# EasyEDA schematic VFD_Clock.json
TITLE: Sheet_1; REV: 1.0; Date: 2023-11-03; Sheet: 1/1; Drawn By: a_qin; Company: Your Company
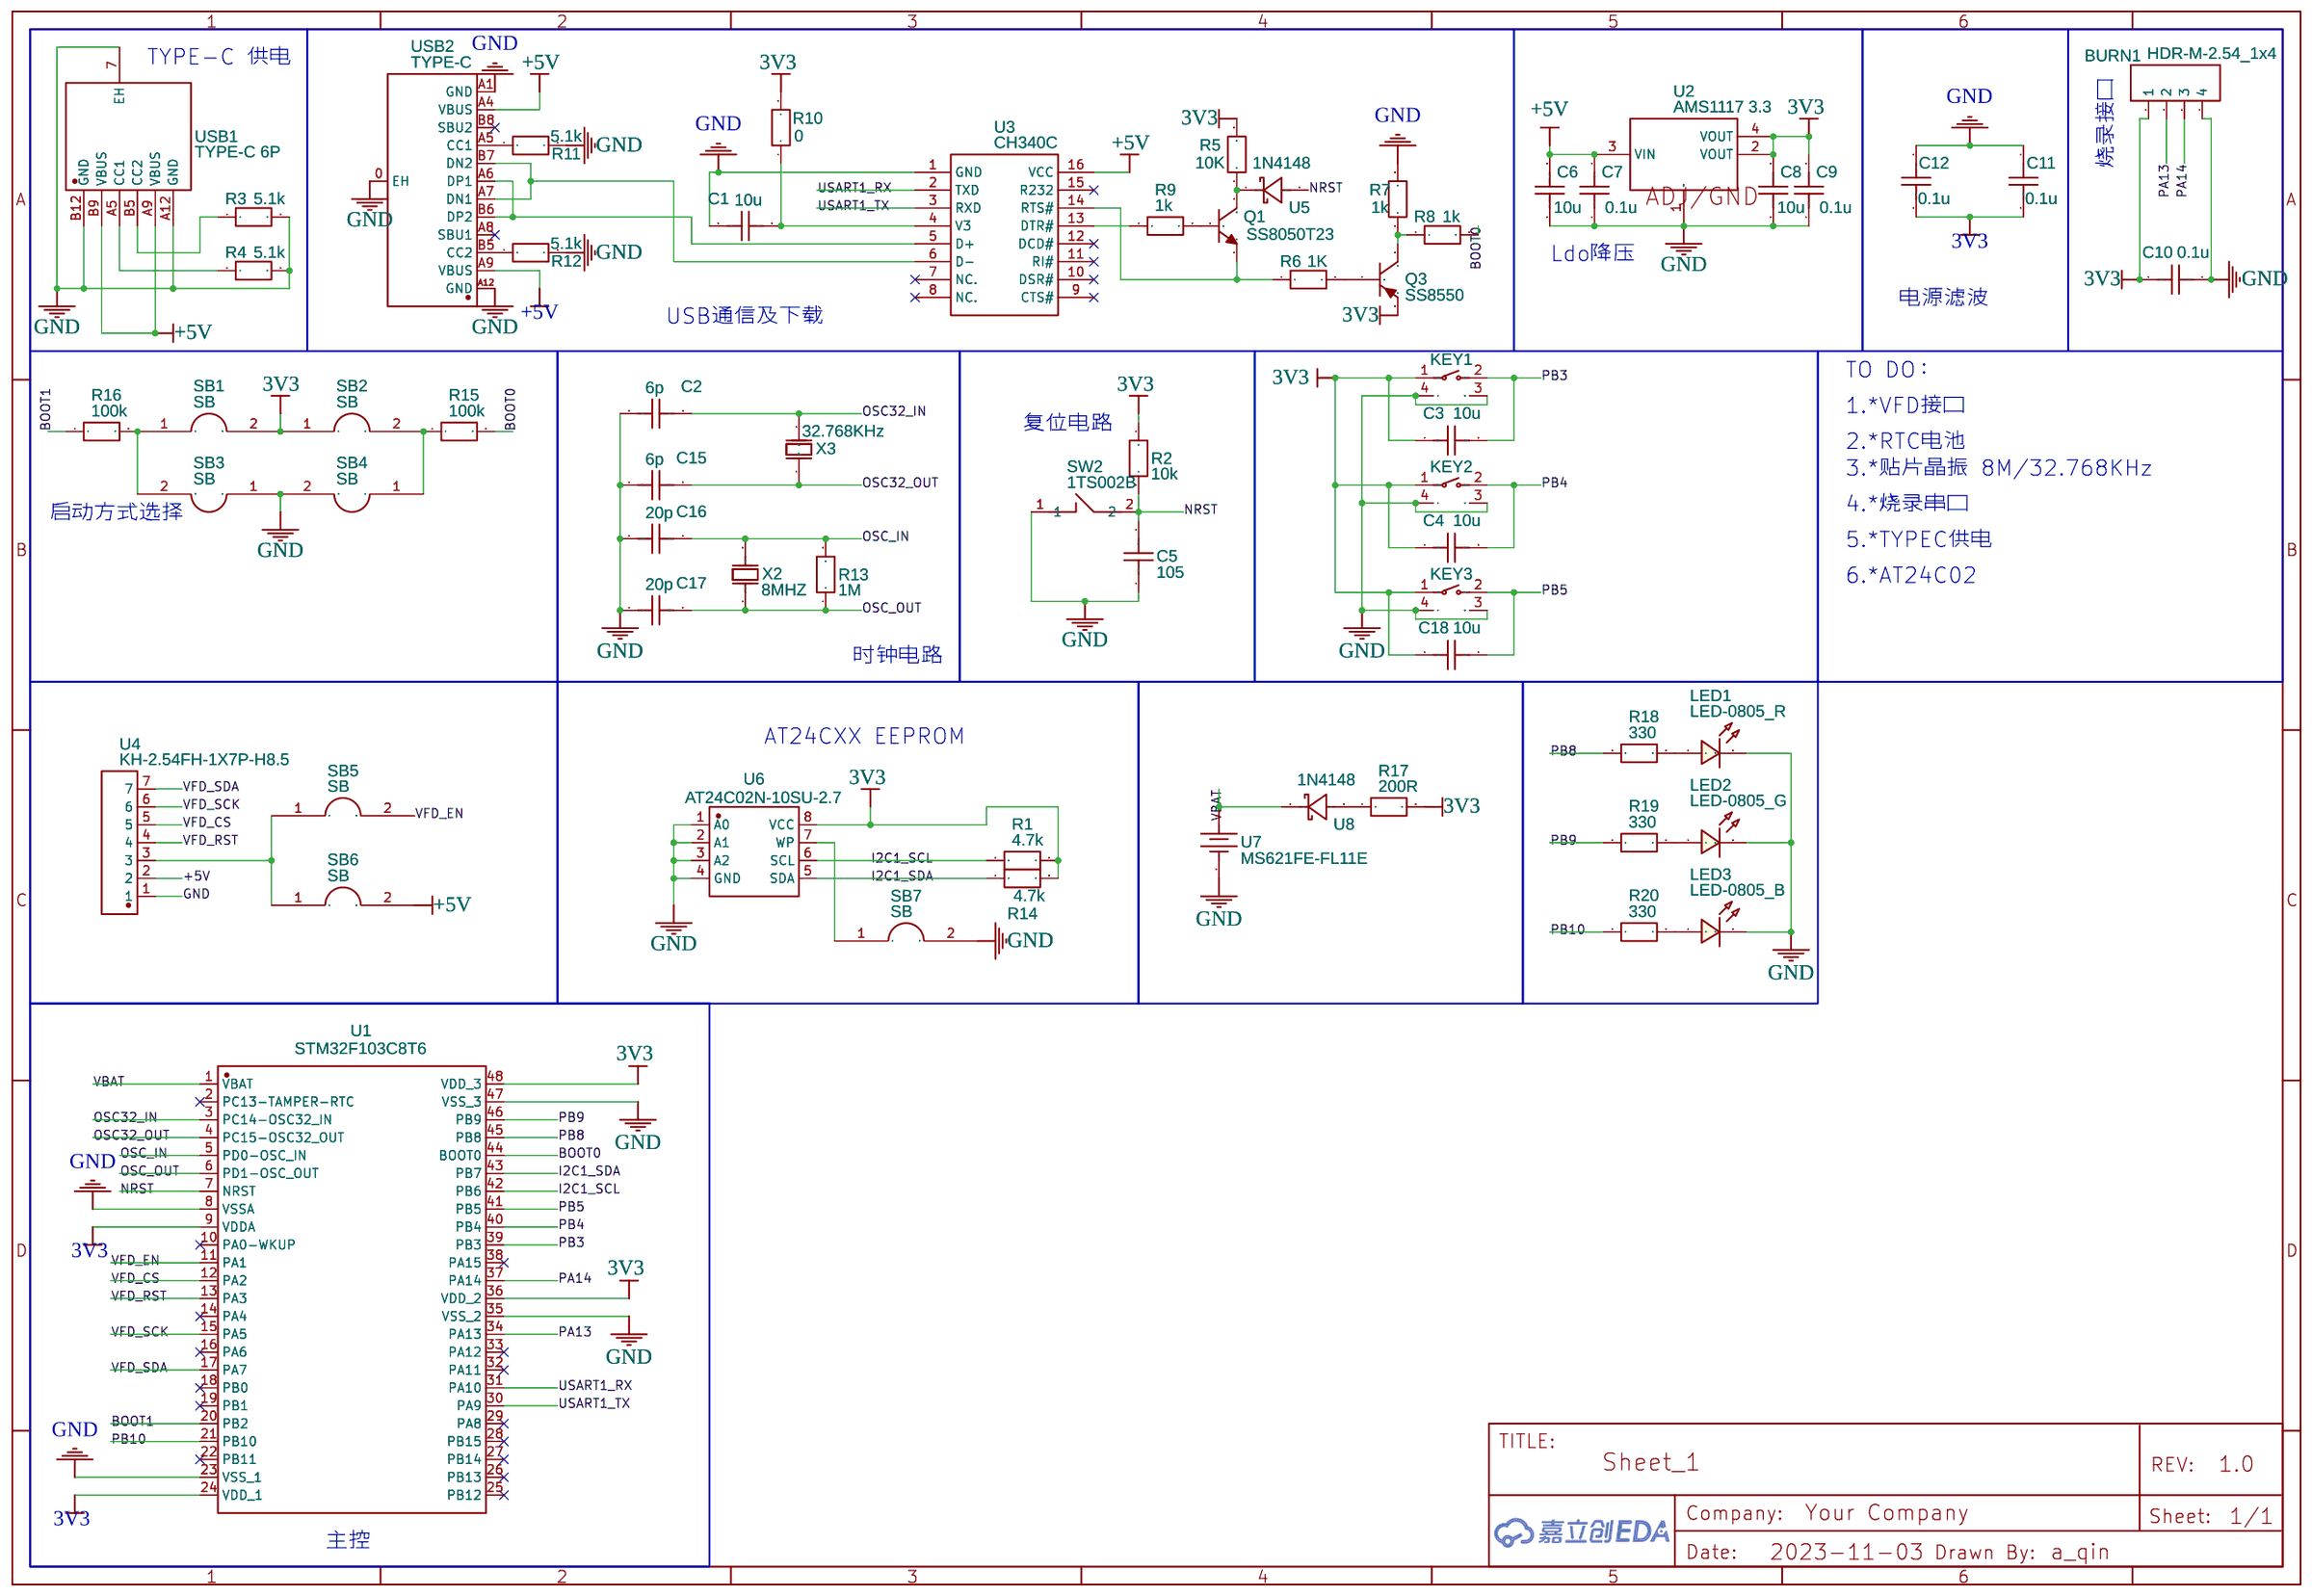
[diagram p0: schematic sheet]

## Parts
BURN1  HDR-M-2.54_1x4  [HDR-M-2.54_1X4]
C1  10u  [C0805]
C2  6p  [C0805]
C3  10u  [C0805]
C4  10u  [C0805]
C5  105  [C0805]
C6  10u  [C0805]
C7  0.1u  [C0805]
C8  10u  [C0805]
C9  0.1u  [C0805]
C10  0.1u  [C0805]
C11  0.1u  [C0805]
C12  0.1u  [C0805]
C15  6p  [C0805]
C16  20p  [C0805]
C17  20p  [C0805]
C18  10u  [C0805]
KEY1  K2-1102AQ-C4CW-01  [SW-TH_K2-1102AQ-C4CW-01]
KEY2  K2-1102AQ-C4CW-01  [SW-TH_K2-1102AQ-C4CW-01]
KEY3  K2-1102AQ-C4CW-01  [SW-TH_K2-1102AQ-C4CW-01]
LED1  LED-0805_R  [LED0805_RED]
LED2  LED-0805_G  [LED0805_GREEN]
LED3  LED-0805_B  [LED0805_BLUE]
Q1  SS8050T23  [SOT-23-3_L2.9-W1.3-P1.90-LS2.4-BR]
Q3  SS8550  [SOT-23-3_L2.9-W1.3-P1.90-LS2.4-BR]
R1  4.7k  [R0805]
R2  10k  [R0805]
R3  5.1k  [R0805]
R4  5.1k  [R0805]
R5  10K  [R0805]
R6  1K  [R0805]
R7  1k  [R0805]
R8  1k  [R0805]
R9  1k  [R0805]
R10  0  [R0805]
R11  5.1k  [R0805]
R12  5.1k  [R0805]
R13  1M  [R0805]
R14  4.7k  [R0805]
R15  100k  [R0805]
R16  100k  [R0805]
R17  200R  [R0805]
R18  330  [R0805]
R19  330  [R0805]
R20  330  [R0805]
SB1  SB  [SB]
SB2  SB  [SB]
SB3  SB  [SB]
SB4  SB  [SB]
SB5  SB  [SB]
SB6  SB  [SB]
SB7  SB  [SB]
SW2  1TS002B  [SW-SMD_L6.0-W3.5-LS8.0]
U1  STM32F103C8T6  [LQFP-48_L7.0-W7.0-P0.50-LS9.0-BL]
U2  AMS1117 3.3  [SOT-223-3_L6.7-W3.7-P2.30-LS7.0-BR]
U3  CH340C  [SOP-16_L10.0-W3.9-P1.27-LS6.0-BL]
U4  KH-2.54FH-1X7P-H8.5  [HDR-TH_7P-P2.54-V-F]
U5  1N4148  [SOD-323_L1.8-W1.3-LS2.7-RD]
U6  AT24C02N-10SU-2.7  [SOIC-8_L4.9-W3.9-P1.27-LS6.0-BL]
U7  MS621FE-FL11E  [BAT-SMD_FL11E]
U8  1N4148  [SOD-323_L1.8-W1.3-LS2.7-RD]
USB1  TYPE-C 6P  [TYPE-C-SMD_TYPE-C-6P]
USB2  TYPE-C  [USB-TYPE-C-SMD_TYPE-C-16P-QTWT]
X2  8MHZ  [HC-49US_L11.0-W4.6-P4.88]
X3  32.768KHz  [OSC-TH_BD2.1-P0.70-D0.3]

## Library data of the parts
BURN1 = HDR-M-2.54_1x4: Supplier Part: C124378; Supplier: LCSC; Contributor: LCEDA_Lib
C1-C12 C15-C18 = C_0805_US: Contributor: LCEDA_Lib
KEY1-KEY3 = K2-1102AQ-C4CW-01: Supplier: LCSC; Manufacturer: 韩国韩荣; Contributor: LCSC; Supplier Part: C127680; JLCPCB Part Class: Extended Part
LED1 = LED-0805_R: Manufacturer: EVERLIGHT(台湾亿光); Manufacturer Part: 17-21SURC/S530-A3/TR8; Supplier Part: C72037; Contributor: LCEDA_Lib
LED2 = LED-0805_G: Manufacturer: 国星光电; Manufacturer Part: NCD0805G1; Supplier Part: C84260; Contributor: LCEDA_Lib
LED3 = LED-0805_B: Manufacturer: 方舟 ARKLED; Manufacturer Part: D-B080508B1-KS2; Supplier Part: C108412; Contributor: LCEDA_Lib
Q1 = SS8050T23: Supplier: LCSC; Supplier Part: C2939671; Manufacturer: Me-TECH(美台高科); Contributor: LCSC; JLCPCB Part Class: Extended Part
Q3 = SS8550-C148468: Supplier: LCSC; Manufacturer: Yenji; Contributor: 立创EDA官方封装库; Supplier Part: C148468
R1-R20 = R_0805_EU: Contributor: LCEDA_Lib
SB1-SB7 = SB: Contributor: lalalaersha
SW2 = 1TS002B-2700-5001: Supplier: LCSC; Supplier Part: C319335; Manufacturer: HYP(鸿源精密); Manufacturer Part: 1TS002B-2700-5001-CT; Contributor: LCSC
U1 = STM32F103C8T6: Supplier: LCSC; Manufacturer: ST(意法半导体); Supplier Part: C8734; JLCPCB Part Class: Basic Part
U2 = LD1117ASTR: Supplier: LCSC; Supplier Part: C283464; Manufacturer: ST(意法半导体); Contributor: LCSC; JLCPCB Part Class: Extended Part
U3 = CH340C: Supplier: LCSC; Manufacturer: WCH(南京沁恒); Supplier Part: C84681; JLCPCB Part Class: Extended Part; link: https://so.szlcsc.com/global.html?k=C84681&ref=editor
U4 = KH-2.54FH-1X7P-H8.5: Contributor: LCSC; Supplier: LCSC; Supplier Part: C2932672; Manufacturer: kinghelm(金航标); JLCPCB Part Class: Extended Part; link: https://so.szlcsc.com/global.html?k=C2932672&ref=editor
U5 U8 = 1N4148WS-HG3-08: Supplier: LCSC; Supplier Part: C3313072; Manufacturer: VISHAY(威世); JLCPCB Part Class: Extended Part; Contributor: lcsc
U6 = AT24C02N-10SU-2.7: Supplier: LCSC; Supplier Part: C2929937; Manufacturer: null; Contributor: LCSC; JLCPCB Part Class: Extended Part
U7 = MS621FE-FL11E: Contributor: LCSC; Supplier: LCSC; Supplier Part: C80909; Manufacturer: Seiko(精工); link: https://so.szlcsc.com/global.html?k=C80909&ref=editor
USB1 = TYPE-C 6P: Supplier: LCSC; Supplier Part: C456012; Manufacturer: SHOU HAN(首韩); Contributor: LCSC; JLCPCB Part Class: Extended Part
USB2 = TYPE-C 16P QTWT: Supplier: LCSC; Supplier Part: C5187472; Manufacturer: SHOU HAN(首韩); Contributor: lcsc; JLCPCB Part Class: Extended Part
X2 = 49SAC08000182060: Supplier: LCSC; Supplier Part: C390747; Manufacturer: JGHC; Contributor: LCSC; JLCPCB Part Class: Extended Part
X3 = CFS-20632768EZFB: Supplier: LCSC; Supplier Part: C326534; Manufacturer: CITIZEN; Contributor: LCSC

## Nets
3V3: BURN1.1 C3.1 C4.1 C8.2 C9.2 C10.2 C11.2 C12.2 C18.1 KEY1.1 KEY2.1 KEY3.1 Q3.2(E) R1.2 R2.2 R5.2 R10.2 R14.2 R17.2 SB1.2 SB2.1 U1.9(VDDA) U1.24(VDD_1) U1.36(VDD_2) U1.48(VDD_3) U2.2(VOUT) U2.4(VOUT) U6.8(VCC)
+5V: C6.2 C7.2 SB6.2 U2.3(VIN) U3.16(VCC) U4.2 USB1.A9(VBUS) USB1.B9(VBUS) USB2.A4(VBUS) USB2.A9(VBUS)
GND: BURN1.4 C1.1 C2.1 C5.1 C6.1 C7.1 C8.1 C9.1 C10.1 C11.1 C12.1 C15.1 C16.1 C17.1 KEY1.3 KEY1.4 KEY2.3 KEY2.4 KEY3.3 KEY3.4 LED1.2 LED2.2 LED3.2 R3.2 R4.2 R7.2 R11.2 R12.2 SB3.1 SB4.2 SB7.2 SW2.1 U1.8(VSSA) U1.23(VSS_1) U1.35(VSS_2) U1.47(VSS_3) U2.1(ADJ/GND) U3.1(GND) U4.1 U6.1(A0) U6.2(A1) U6.3(A2) U6.4(GND) U7.2(-) USB1.7(EH) USB1.A12(GND) USB1.B12(GND) USB2.0(EH) USB2.A1(GND) USB2.A12(GND)
VBAT: U1.1(VBAT) U7.1(+) U8.1(K)
BOOT0: R8.2 R15.2 U1.44(BOOT0)
BOOT1: R16.1 U1.20(PB2)
I2C1_SCL: R1.1 U1.42(PB6) U6.6(SCL)
I2C1_SDA: R14.1 U1.43(PB7) U6.5(SDA)
NRST: C5.2 R2.1 SW2.2 U1.7(NRST) U5.2(A)
OSC32_IN: C2.2 U1.3(PC14-OSC32_IN) X3.2(OSC2)
OSC32_OUT: C15.2 U1.4(PC15-OSC32_OUT) X3.1(OSC1)
OSC_IN: C16.2 R13.2 U1.5(PD0-OSC_IN) X2.2(OSC2)
OSC_OUT: C17.2 R13.1 U1.6(PD1-OSC_OUT) X2.1(OSC1)
PA13: BURN1.2 U1.34(PA13)
PA14: BURN1.3 U1.37(PA14)
PB3: C3.2 KEY1.2 U1.39(PB3)
PB4: C4.2 KEY2.2 U1.40(PB4)
PB5: C18.2 KEY3.2 U1.41(PB5)
PB8: R18.1 U1.45(PB8)
PB9: R19.1 U1.46(PB9)
PB10: R20.1 U1.21(PB10)
USART1_RX: U1.31(PA10) U3.2(TXD)
USART1_TX: U1.30(PA9) U3.3(RXD)
VFD_CS: U1.12(PA2) U4.5
VFD_EN: SB5.2 U1.11(PA1)
VFD_RST: U1.13(PA3) U4.4
VFD_SCK: U1.15(PA5) U4.6
VFD_SDA: U1.17(PA7) U4.7
Net-(C1-2): C1.2 R10.1 U3.4(V3)
Net-(LED1-1): LED1.1 R18.2
Net-(LED2-1): LED2.1 R19.2
Net-(LED3-1): LED3.1 R20.2
Net-(Q1-1): Q1.1(B) R9.2
Net-(Q1-2): Q1.2(E) R6.1 U3.14(RTS#)
Net-(Q1-3): Q1.3(C) R5.1 U5.1(K)
Net-(Q3-1): Q3.1(B) R6.2
Net-(Q3-3): Q3.3(C) R7.1 R8.1
Net-(R3-1): R3.1 USB1.B5(CC2)
Net-(R4-1): R4.1 USB1.A5(CC1)
Net-(R9-1): R9.1 U3.13(DTR#)
Net-(R11-1): R11.1 USB2.A5(CC1)
Net-(R12-1): R12.1 USB2.B5(CC2)
Net-(R15-1): R15.1 SB2.2 SB4.1
Net-(R16-2): R16.2 SB1.1 SB3.2
Net-(R17-1): R17.1 U8.2(A)
Net-(SB5-1): SB5.1 SB6.1 U4.3
Net-(SB7-1): SB7.1 U6.7(WP)
Net-(U3-5): U3.5(D+) USB2.A6(DP1) USB2.B6(DP2)
Net-(U3-6): U3.6(D-) USB2.A7(DN1) USB2.B7(DN2)

Not connected (* = marked no-connect by the designer): U1 2(PC13-TAMPER-RTC)* 10(PA0-WKUP)* 14(PA4)* 16(PA6)* 18(PB0)* 19(PB1)* 22(PB11)* 25(PB12)* 26(PB13)* 27(PB14)* 28(PB15)* 29(PA8)* 32(PA11)* 33(PA12)* 38(PA15)*; U3 7(NC.)* 8(NC.)* 9(CTS#)* 10(DSR#)* 11(RI#)* 12(DCD#)* 15(R232)*; USB2 A8(SBU1)* B8(SBU2)*

## Notes on the sheet
- TYPE-C 供电
- 烧录接口
- Ldo降压
- 电源滤波
- USB通信及下载
- TO DO：
- 1.*VFD接口
- 复位电路
- 2.*RTC电池
- 3.*贴片晶振 8M/32.768KHz
- 启动方式选择
- 4.*烧录串口
- 5.*TYPEC供电
- 6.*AT24C02
- 时钟电路
- AT24CXX EEPROM
- 主控
